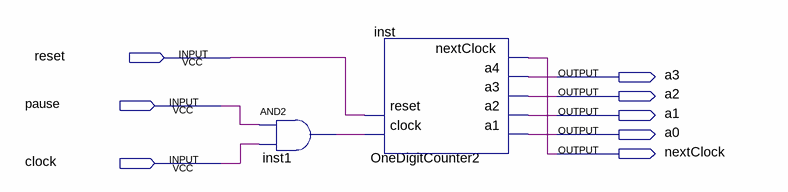
[diagram p0: schematic sheet]
// Quartus schematic cronometroMin.bdf as structural Verilog: 2 symbols, 8 pins
module cronometroMin (
  input  reset,
  input  pause,
  input  clock,
  output a3,
  output a2,
  output a1,
  output a0,
  output nextClock
);

  wire inst1_out;

  and inst1 (inst1_out, pause, clock);
  OneDigitCounter2 inst (.clock(inst1_out), .reset(reset), .a1(a0), .a2(a1), .a3(a2), .a4(a3), .nextClock(nextClock));
endmodule
